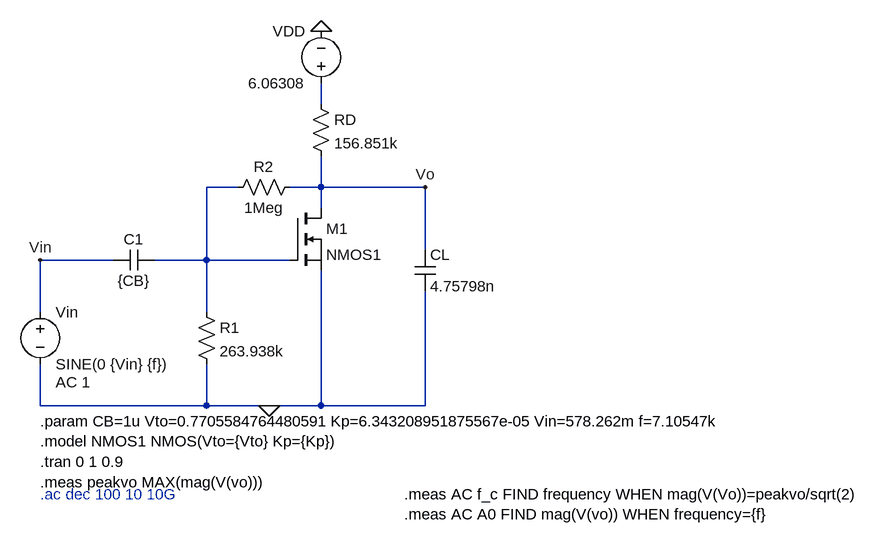
[diagram p0: schematic class_A_amp.asc]
class_A_amp.asc, the LTspice schematic file:
Version 4.1
SHEET 1 1680 680
WIRE 592 -192 592 -224
WIRE 464 -64 416 -64
WIRE 592 -64 592 -112
WIRE 592 -64 544 -64
WIRE 752 -64 592 -64
WIRE 592 -32 592 -64
WIRE 752 32 752 -64
WIRE 272 48 160 48
WIRE 416 48 416 -64
WIRE 416 48 336 48
WIRE 544 48 416 48
WIRE 160 128 160 48
WIRE 416 128 416 48
WIRE 160 272 160 208
WIRE 416 272 416 208
WIRE 416 272 160 272
WIRE 512 272 416 272
WIRE 592 272 592 64
WIRE 592 272 512 272
WIRE 752 272 752 96
WIRE 752 272 592 272
FLAG 512 272 0
FLAG 592 -304 0
FLAG 160 48 Vin
FLAG 752 -64 Vo
SYMBOL voltage 160 112 R0
WINDOW 123 24 124 Left 2
WINDOW 39 0 0 Left 0
SYMATTR Value2 AC 1
SYMATTR InstName Vin
SYMATTR Value SINE(0 {Vin} {f})
SYMBOL cap 336 32 R90
WINDOW 0 0 32 VBottom 2
WINDOW 3 32 32 VTop 2
SYMATTR InstName C1
SYMATTR Value {CB}
SYMBOL res 400 112 R0
SYMATTR InstName R1
SYMATTR Value 263.938k
SYMBOL res 560 -80 R90
WINDOW 0 0 56 VBottom 2
WINDOW 3 32 56 VTop 2
SYMATTR InstName R2
SYMATTR Value 1Meg
SYMBOL nmos 544 -32 R0
SYMATTR InstName M1
SYMATTR Value NMOS1
SYMBOL res 576 -208 R0
SYMATTR InstName RD
SYMATTR Value 156.851k
SYMBOL voltage 592 -208 R180
WINDOW 0 24 96 Left 2
WINDOW 3 24 16 Left 2
SYMATTR InstName VDD
SYMATTR Value 6.06308
SYMBOL cap 736 32 R0
SYMATTR InstName CL
SYMATTR Value 4.75798n
TEXT 160 296 Left 2 !.param CB=1u Vto=0.7705584764480591 Kp=6.343208951875567e-05 Vin=578.262m f=7.10547k\n.model NMOS1 NMOS(Vto={Vto} Kp={Kp})\n.tran 0 1 0.9\n.meas peakvo MAX(mag(V(vo)))
TEXT 160 408 Left 2 ;.ac dec 100 10 10G
TEXT 720 408 Left 2 !.meas AC f_c FIND frequency WHEN mag(V(Vo))=peakvo/sqrt(2)\n.meas AC A0 FIND mag(V(vo)) WHEN frequency={f}

The netlist it stands for:
* class_A_amp.asc
Vin Vin 0 SINE(0 {Vin} {f}) AC 1
C1 N002 Vin {CB}
R1 N002 0 263.938k
R2 Vo N002 1Meg
M1 Vo N002 0 0 NMOS1
RD N001 Vo 156.851k
VDD N001 0 6.06308
CL Vo 0 4.75798n
.model NMOS NMOS
.model PMOS PMOS
.lib standard.mos
.param CB=1u Vto=0.7705584764480591 Kp=6.343208951875567e-05 Vin=578.262m f=7.10547k
.model NMOS1 NMOS(Vto={Vto} Kp={Kp})
.tran 0 1 0.9
.meas peakvo MAX(mag(V(vo)))
* .ac dec 100 10 10G
.meas AC f_c FIND frequency WHEN mag(V(Vo))=peakvo/sqrt(2)
.meas AC A0 FIND mag(V(vo)) WHEN frequency={f}
.backanno
.end